# Altium schematic sheet MID_AR0234.SchDoc: =project_title
size Tabloid; PageSetup: Record=PageOptions|CenterHorizontal=True|CenterVertical=True|PrintScale=0.71|XCorrection=1.00|YCorrection=1.00|PrintKind=0|BorderSize=5000000|LeftOffset=0|BottomOffset=0|Orientation=2|PaperLength=1000|PaperWidth=1000|Scale=100|PaperSource=7|PrintQuality=-4|MediaType=1|DitherType=10|PrintScaleMode=1|PaperKind=A4; CompanyName: Luxonis Holding; Organization: Luxonis Holding; Address1: 1925 Harmony Park Drive; Address2: Westminster, CO; Address3: 80234; Address4: United States; SheetNumber: 5; SheetTotal: 11
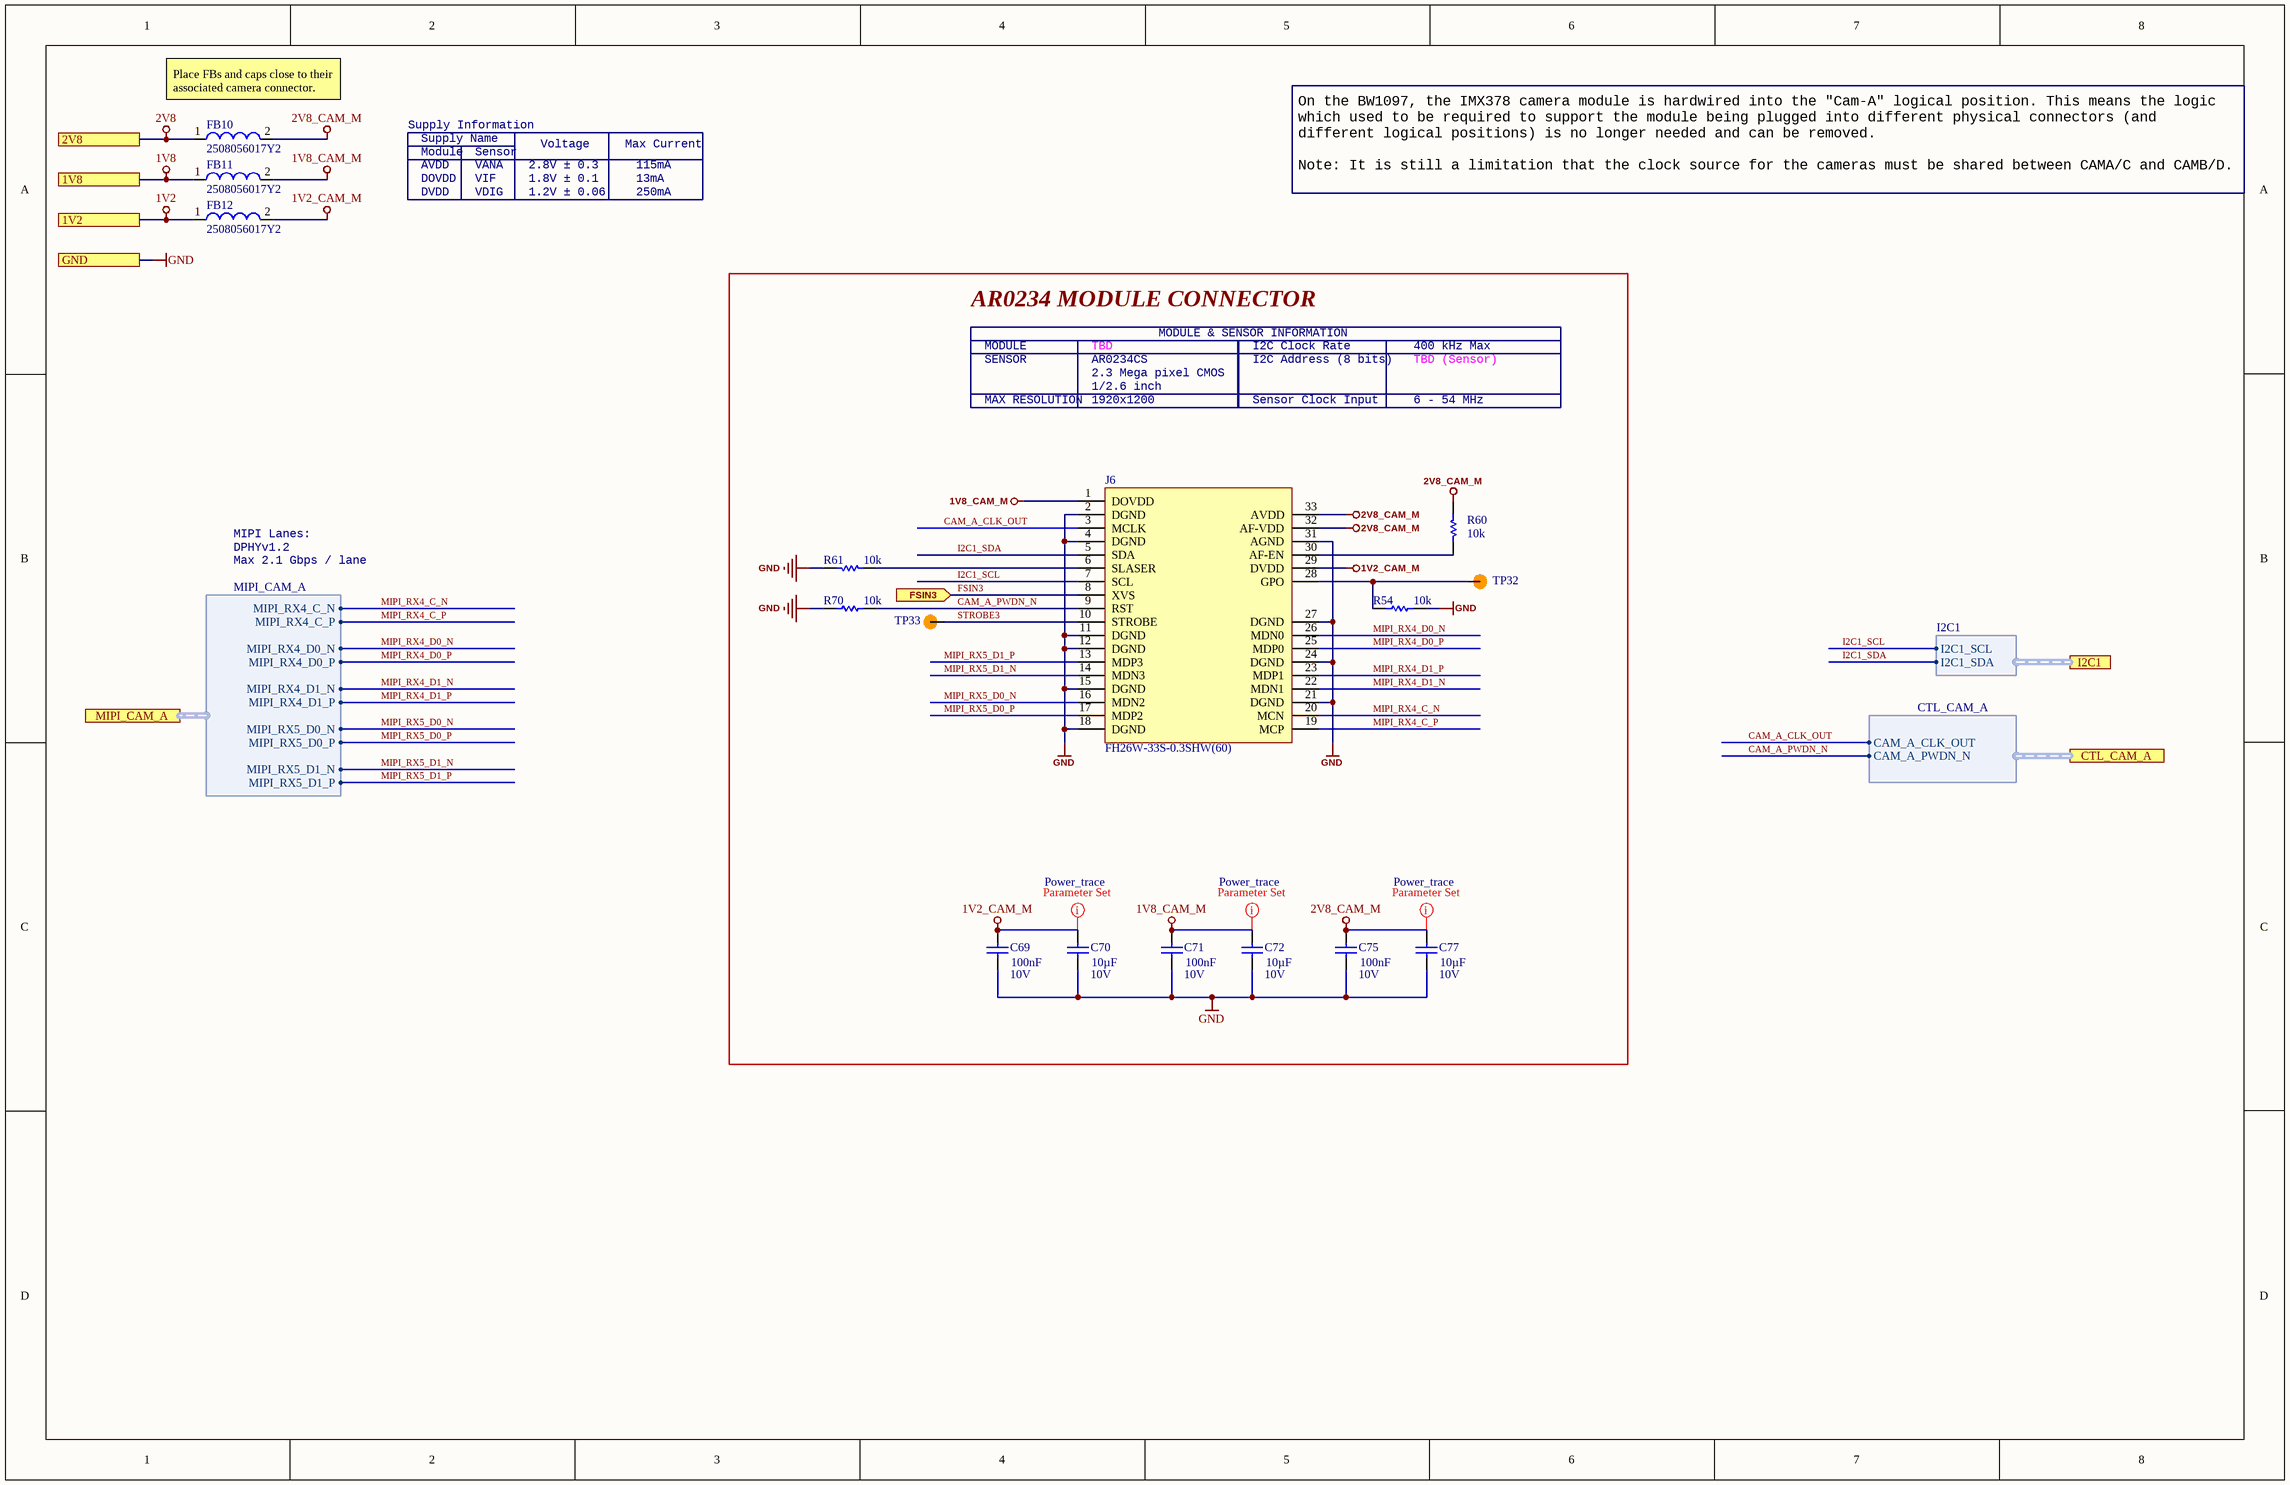
[diagram p0: MID_AR0234.SchDoc]

## Parts
C69  value 100nF  Voltage Rating: 10V  [CAPC0402(1005)70_L]  (hidden comment: GRM155R71A104JA01D)
C70  value 10µF  Voltage Rating: 10V  [CAPC0603(1608)100_L]  (hidden comment: GRM188R61A106ME69D)
C71  value 100nF  Voltage Rating: 10V  [CAPC0402(1005)70_L]  (hidden comment: GRM155R71A104JA01D)
C72  value 10µF  Voltage Rating: 10V  [CAPC0603(1608)100_L]  (hidden comment: GRM188R61A106ME69D)
C75  value 100nF  Voltage Rating: 10V  [CAPC0402(1005)70_L]  (hidden comment: GRM155R71A104JA01D)
C77  value 10µF  Voltage Rating: 10V  [CAPC0603(1608)100_L]  (hidden comment: GRM188R61A106ME69D)
FB10  2508056017Y2  [2508056017Y2]
FB11  2508056017Y2  [2508056017Y2]
FB12  2508056017Y2  [2508056017Y2]
J6  FH26W-33S-0.3SHW(60)  [FH26W-33S-0.3SHW(60)]
R54  value 10k  [RESC0402(1005)_L]  (hidden comment: RC0402FR-1310KL)
R60  value 10k  [RESC0402(1005)_L]  (hidden comment: RC0402FR-1310KL)
R61  value 10k  [RESC0402(1005)_L]  (hidden comment: RC0402FR-1310KL)
R70  value 10k  [RESC0402(1005)_L]  (hidden comment: RC0402FR-1310KL)
TP32  TEST_POINT  [TP100_200_NS]  (value not drawn)  (no BOM)
TP33  TEST_POINT  [TP100_200_NS]  (value not drawn)  (no BOM)

## Blocks framed on the sheet
AR0234 MODULE CONNECTOR: C69-C72 C75 C77 J6 R54 R60 R61 R70 TP32 TP33

## Ports
1V2, 1V8, 2V8, CTL_CAM_A (harness CTL_CAM_A), FSIN3 (in), GND, I2C1 (harness I2C1), MIPI_CAM_A (harness MIPI_CAM_A)

## Harnesses
I2C1: I2C1_SDA, I2C1_SCL
MIPI_CAM_A: MIPI_RX4_C_P, MIPI_RX4_C_N, MIPI_RX4_D0_P, MIPI_RX4_D0_N, MIPI_RX4_D1_P, MIPI_RX4_D1_N, MIPI_RX5_D0_P, MIPI_RX5_D0_N, MIPI_RX5_D1_P, MIPI_RX5_D1_N
CTL_CAM_A: CAM_A_PWDN_N, CAM_A_CLK_OUT

## Nets
1V2: FB12.1 ; port 1V2
1V2_CAM_M: C69.2 C70.2 FB12.2 J6.29(DVDD)
1V8: FB11.1 ; port 1V8
1V8_CAM_M: C71.2 C72.2 FB11.2 J6.1(DOVDD)
2V8: FB10.1 ; port 2V8
2V8_CAM_M: C75.2 C77.2 FB10.2 J6.32(AF-VDD) J6.33(AVDD) R60.1
GND: C69.1 C70.1 C71.1 C72.1 C75.1 C77.1 J6.2(DGND) J6.4(DGND) J6.11(DGND) J6.12(DGND) J6.15(DGND) J6.18(DGND) J6.21(DGND) J6.24(DGND) J6.27(DGND) J6.31(AGND) R54.2 R61.2 R70.1 ; port GND
CAM_A_CLK_OUT: J6.3(MCLK) ; port CTL_CAM_A.CAM_A_CLK_OUT
CAM_A_PWDN_N: J6.9(RST) R70.2 ; port CTL_CAM_A.CAM_A_PWDN_N
FSIN3: J6.8(XVS) ; port FSIN3
I2C1_SCL: J6.7(SCL) ; port I2C1.I2C1_SCL
I2C1_SDA: J6.5(SDA) ; port I2C1.I2C1_SDA
MIPI_RX4_C_N: J6.20(MCN) ; port MIPI_CAM_A.MIPI_RX4_C_N
MIPI_RX4_C_P: J6.19(MCP) ; port MIPI_CAM_A.MIPI_RX4_C_P
MIPI_RX4_D0_N: J6.26(MDN0) ; port MIPI_CAM_A.MIPI_RX4_D0_N
MIPI_RX4_D0_P: J6.25(MDP0) ; port MIPI_CAM_A.MIPI_RX4_D0_P
MIPI_RX4_D1_N: J6.22(MDN1) ; port MIPI_CAM_A.MIPI_RX4_D1_N
MIPI_RX4_D1_P: J6.23(MDP1) ; port MIPI_CAM_A.MIPI_RX4_D1_P
MIPI_RX5_D0_N: J6.16(MDN2) ; port MIPI_CAM_A.MIPI_RX5_D0_N
MIPI_RX5_D0_P: J6.17(MDP2) ; port MIPI_CAM_A.MIPI_RX5_D0_P
MIPI_RX5_D1_N: J6.14(MDN3) ; port MIPI_CAM_A.MIPI_RX5_D1_N
MIPI_RX5_D1_P: J6.13(MDP3) ; port MIPI_CAM_A.MIPI_RX5_D1_P
STROBE3: J6.10(STROBE) TP33.1
NetJ6_6: J6.6(SLASER) R61.1
NetJ6_28: J6.28(GPO) R54.1 TP32.1
NetJ6_30: J6.30(AF-EN) R60.2

## Layout directives
net class Power_trace: 1V2_CAM_M, 1V8_CAM_M, 2V8_CAM_M

## Notes on the sheet
- (near FB10) Place FBs and caps close to their associated camera connector.
- Supply Information
- AVDD
- Supply Name
- Module
- VANA
- Sensor
- 2.8V ± 0.3
- Voltage
- Max Current
- 115mA
- DOVDD
- DVDD
- VIF
- VDIG
- 1.8V ± 0.1
- 1.2V ± 0.06
- 13mA
- 250mA
- On the BW1097, the IMX378 camera module is hardwired into the "Cam-A" logical position. This means the logic which used to be required to support the module being plugged into different physical connectors (and different logical positions) is no longer needed and can be removed.
  Note: It is still a limitation that the clock source for the cameras must be shared between CAMA/C and CAMB/D.
- SENSOR
- MODULE
- AR0234CS
- TBD
- MODULE & SENSOR INFORMATION
- I2C Address (8 bits)
- I2C Clock Rate
- TBD (Sensor)
- 400 kHz Max
- MAX RESOLUTION
- 2.3 Mega pixel CMOS
- 1920x1200
- 1/2.6 inch
- Sensor Clock Input
- 6 - 54 MHz
- MIPI Lanes:
- Max 2.1 Gbps / lane
- DPHYv1.2
- Title
- Size:
- Date:
- Tabloid
- Number:
- Time:
- Revision:
- Sheet
- of
- Drawn by:

## Library data of the parts
C69 C71 C75 = CMP-108-000015-5: CAP CER 0.1UF 10V X7R 0402 5%; Manufacturer 1: Murata; Manufacturer Part Number 1: GRM155R71A104JA01D; Case/Package: 0402; Min Operating Temperature: -55°C; Max Operating Temperature: 125°C; Tolerance: 5%; Dielectric: X7R; Length: 1mm; Height: 0.5mm; Width: 0.02inch; Depth: 0.5mm; ComponentLink1URL: https://datasheet.ciiva.com/5411/product-5411135.pdf?src-supplier=Mouser; ComponentLink1Description: https://datasheet.ciiva.com/5411/product-5411135.pdf?src-supplier=Mouser; ComponentLink2URL: https://datasheet.ciiva.com/11618/c02e-11618821.pdf?src-supplier=Avnet; ComponentLink2Description: https://datasheet.ciiva.com/11618/c02e-11618821.pdf?src-supplier=Avnet; Design Item ID: GRM155R71A104JA01D; Mounting Technology: SMT
C70 C72 C77 = CMP-004-000018-4: CAP CER 10UF 10V X5R 0603 20%; Manufacturer 1: Murata; Manufacturer Part Number 1: GRM188R61A106ME69D; Case/Package: 0603; Min Operating Temperature: -55°C; Max Operating Temperature: 85°C; Tolerance: 20%; Dielectric: X5R; Length: 1.6mm; Height: 0.8mm; Width: 0.8mm; Depth: 0.8mm; ComponentLink1URL: http://www.mouser.com/ds/2/281/c02e-2905.pdf?src-supplier=Mouser; ComponentLink1Description: http://www.mouser.com/ds/2/281/c02e-2905.pdf?src-supplier=Mouser; ComponentLink2URL: http://components.arrow.com/part/dataview/0323_06119472?src-supplier=Arrow+Europe; ComponentLink2Description: http://components.arrow.com/part/dataview/0323_06119472?src-supplier=Arrow+Europe; ComponentLink3URL: http://www.farnell.com/datasheets/2048014.pdf?src-supplier=Farnell; ComponentLink3Description: http://www.farnell.com/datasheets/2048014.pdf?src-supplier=Farnell; ComponentLink4URL: http://www.farnell.com/datasheets/1872210.pdf?src-supplier=Farnell; ComponentLink4Description: http://www.farnell.com/datasheets/1872210.pdf?src-supplier=Farnell; ComponentLink5URL: http://search.murata.co.jp/Ceramy/image/img/A01X/G101/ENG/GRM188R61A106ME69-01.pdf?src-supplier=Digi-Key; ComponentLink5Description: http://search.murata.co.jp/Ceramy/image/img/A01X/G101/ENG/GRM188R61A106ME69-01.pdf?src-supplier=Digi-Key; ComponentLink6URL: http://www.farnell.com/datasheets/1872210.pdf?src-supplier=Newark; ComponentLink6Description: http://www.farnell.com/datasheets/1872210.pdf?src-supplier=Newark; ComponentLink7URL: http://www.farnell.com/datasheets/2048014.pdf?src-supplier=Element14; ComponentLink7Description: http://www.farnell.com/datasheets/2048014.pdf?src-supplier=Element14; ComponentLink8URL: http://www.farnell.com/datasheets/2048014.pdf?src-supplier=Newark; ComponentLink8Description: http://www.farnell.com/datasheets/2048014.pdf?src-supplier=Newark; Design Item ID: GRM188R61A106ME69D; Mounting Technology: SMT
FB10-FB12 = CMP-082-000000-2: FERRITE BEAD, 0.1OHM, 2A, 0805, 600R/100MHz; Manufacturer 1: Fair-Rite; Tolerance: 25%; Manufacturer Part Number 1: 2508056017Y2; Case/Package: 0805; Current Rating: 2A
J6 = CMP-002-00090-3: FFC/FPC Connector, 33 Contact(s), 1 Row(s), Female, Right Angle, Surface Mount Terminal; Manufacturer 1: Hirose; Manufacturer Part Number 1: FH26W-33S-0.3SHW(60); RoHS: Yes; Category: FFC / FPC; Stock 1: 627; Pricing 1: 1=1,78000, 10=1,61700, 25=1,51800, 50=1,45200, 100=1,38600, 250=1,25400, 500=1,15500, 1000=0,99000, 2500=0,92400 (USD); ComponentLink1URL: https://datasheet.ciiva.com:443/pdfs/VipMasterIC/IC/HIRO/HIRO-S-A0007913874/HIRO-S-A0008593114-1.pdf?src-supplier=IHS+Markit; ComponentLink1Description: https://datasheet.ciiva.com:443/pdfs/VipMasterIC/IC/HIRO/HIRO-S-A0007913874/HIRO-S-A0008593114-1.pdf?src-supplier=IHS+Markit; ComponentLink2URL: https://www.hirose.com/product/en/download_file/key_name/FH26/category/Catalog/doc_file_id/49355/?file_category_id=4&item_id=298&is_series=1&src-supplier=Digi-Key; ComponentLink2Description: https://www.hirose.com/product/en/download_file/key_name/FH26/category/Catalog/doc_file_id/49355/?file_category_id=4&item_id=298&is_series=1&src-supplier=Digi-Key; ComponentLink3URL: https://www.hirose.com/product/download/?distributor=digikey&amp;type=2d&amp;lang=en&amp;num=FH26W-13S-0.3SHW(60)&src-supplier=Digi-Key; ComponentLink3Description: https://www.hirose.com/product/download/?distributor=digikey&amp;type=2d&amp;lang=en&amp;num=FH26W-13S-0.3SHW(60)&src-supplier=Digi-Key; Design Item ID: FH26W-33S-0.3SHW(60); Pins: 33; Source: LuxonisMaster.SchLib
R54 R60 R61 R70 = CMP-115-000004-8: RES SMD 10K OHM 1% 1/16W 0402; Manufacturer 1: Yageo; Temperature Coefficient: 100ppm/°C; Power Rating: 62.5mW; Voltage Rating: 50V; Manufacturer Part Number 1: RC0402FR-1310KL; Case/Package: 0402; Min Operating Temperature: -55°C; Max Operating Temperature: 155°C; Tolerance: 1%; Design Item ID: RC0402FR-1310KL
TP32 TP33 = CMP-015-000000-2: Manufacturer Part Number 1: /; Design Item ID: TEST_POINT; Source: LuxonisMaster.SchLib